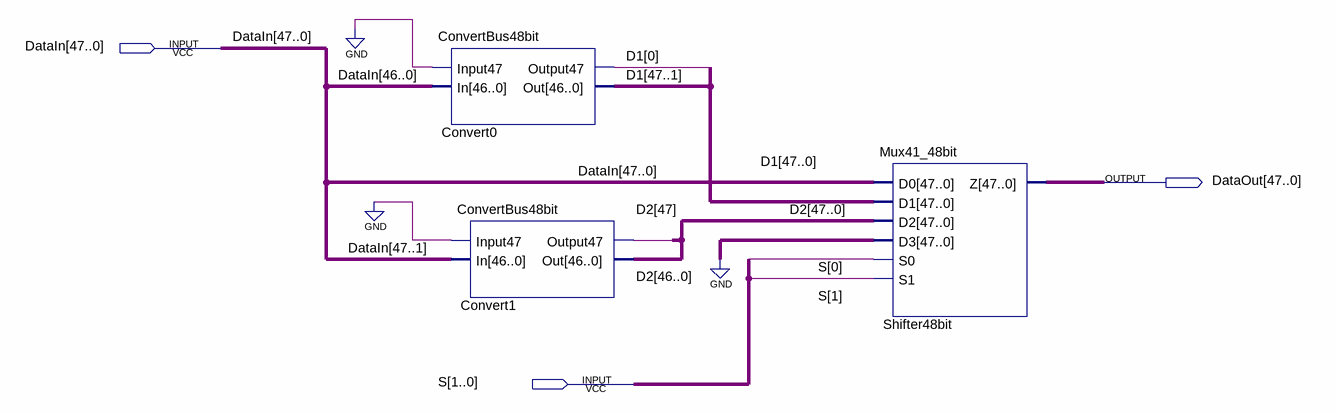
[diagram p0: schematic sheet]
// Quartus schematic Shifter_48bit.bdf as structural Verilog: 3 symbols, 3 pins
module Shifter_48bit (
  input  [47:0] DataIn,
  input  [1:0] S,
  output [47:0] DataOut
);

  wire [47:0] D1, D2;

  ConvertBus48bit Convert0 (.Input47(1'b0), .In(DataIn[46:0]), .Output47(D1[0]), .Out(D1[47:1]));
  ConvertBus48bit Convert1 (.Input47(1'b0), .In(DataIn[47:1]), .Output47(D2[47]), .Out(D2[46:0]));
  Mux41_48bit Shifter48bit (.D0(DataIn), .D1(D1), .D2(D2), .D3({48{1'b0}}), .S0(S[0]), .S1(S[1]), .Z(DataOut));
endmodule
